# EAGLE schematic 7seg_clock (EAGLE 9.6.2)
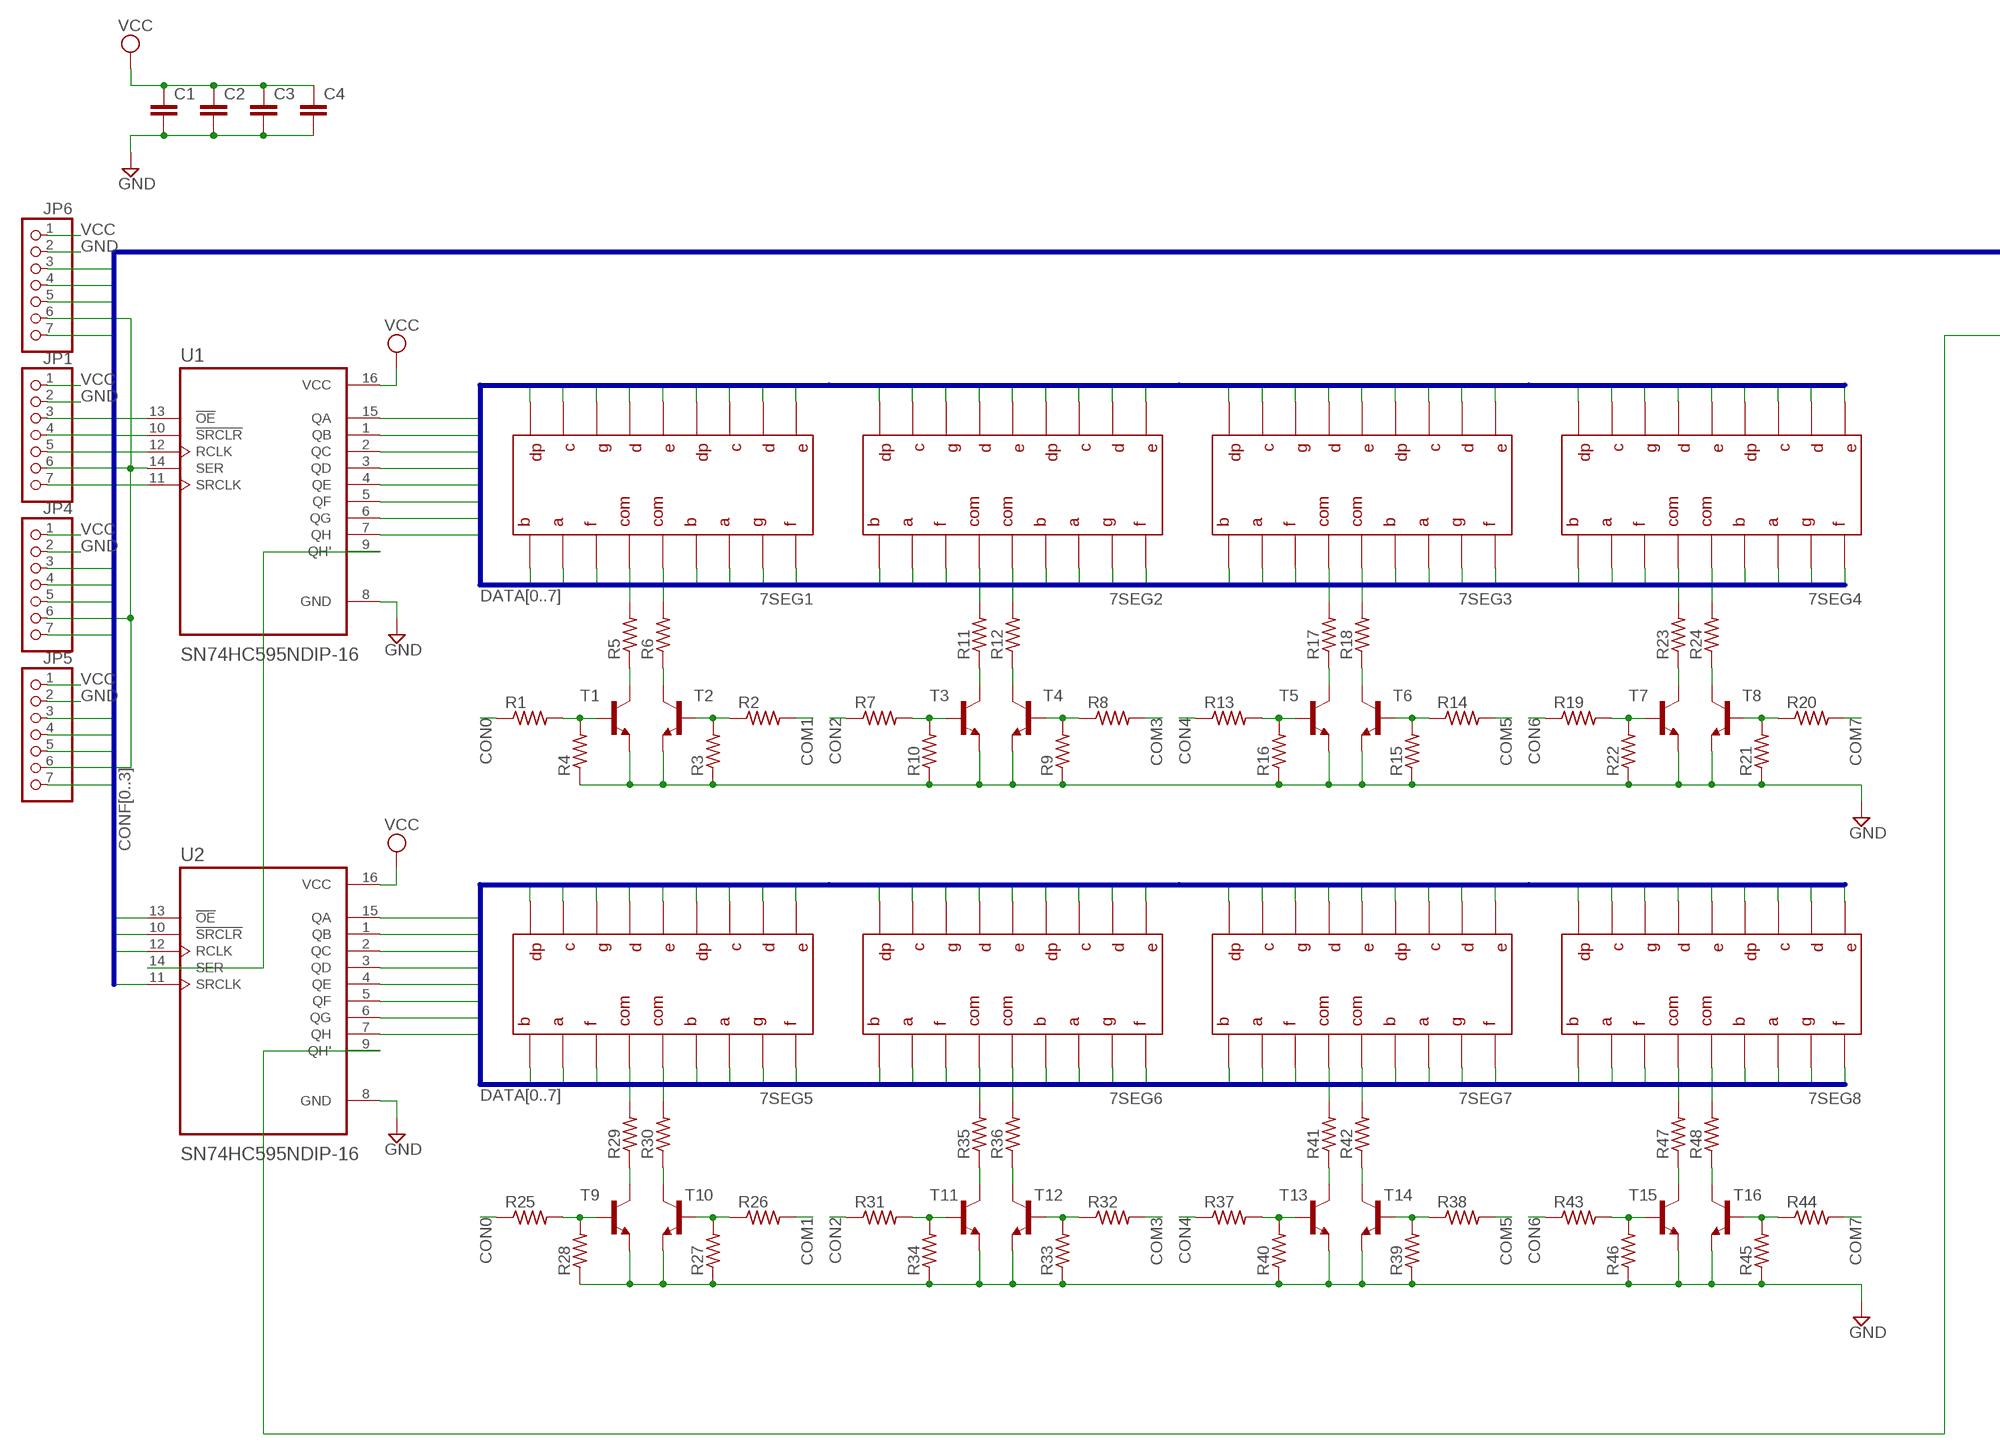
[diagram p0: schematic, sheet 1, part 1 of 2]
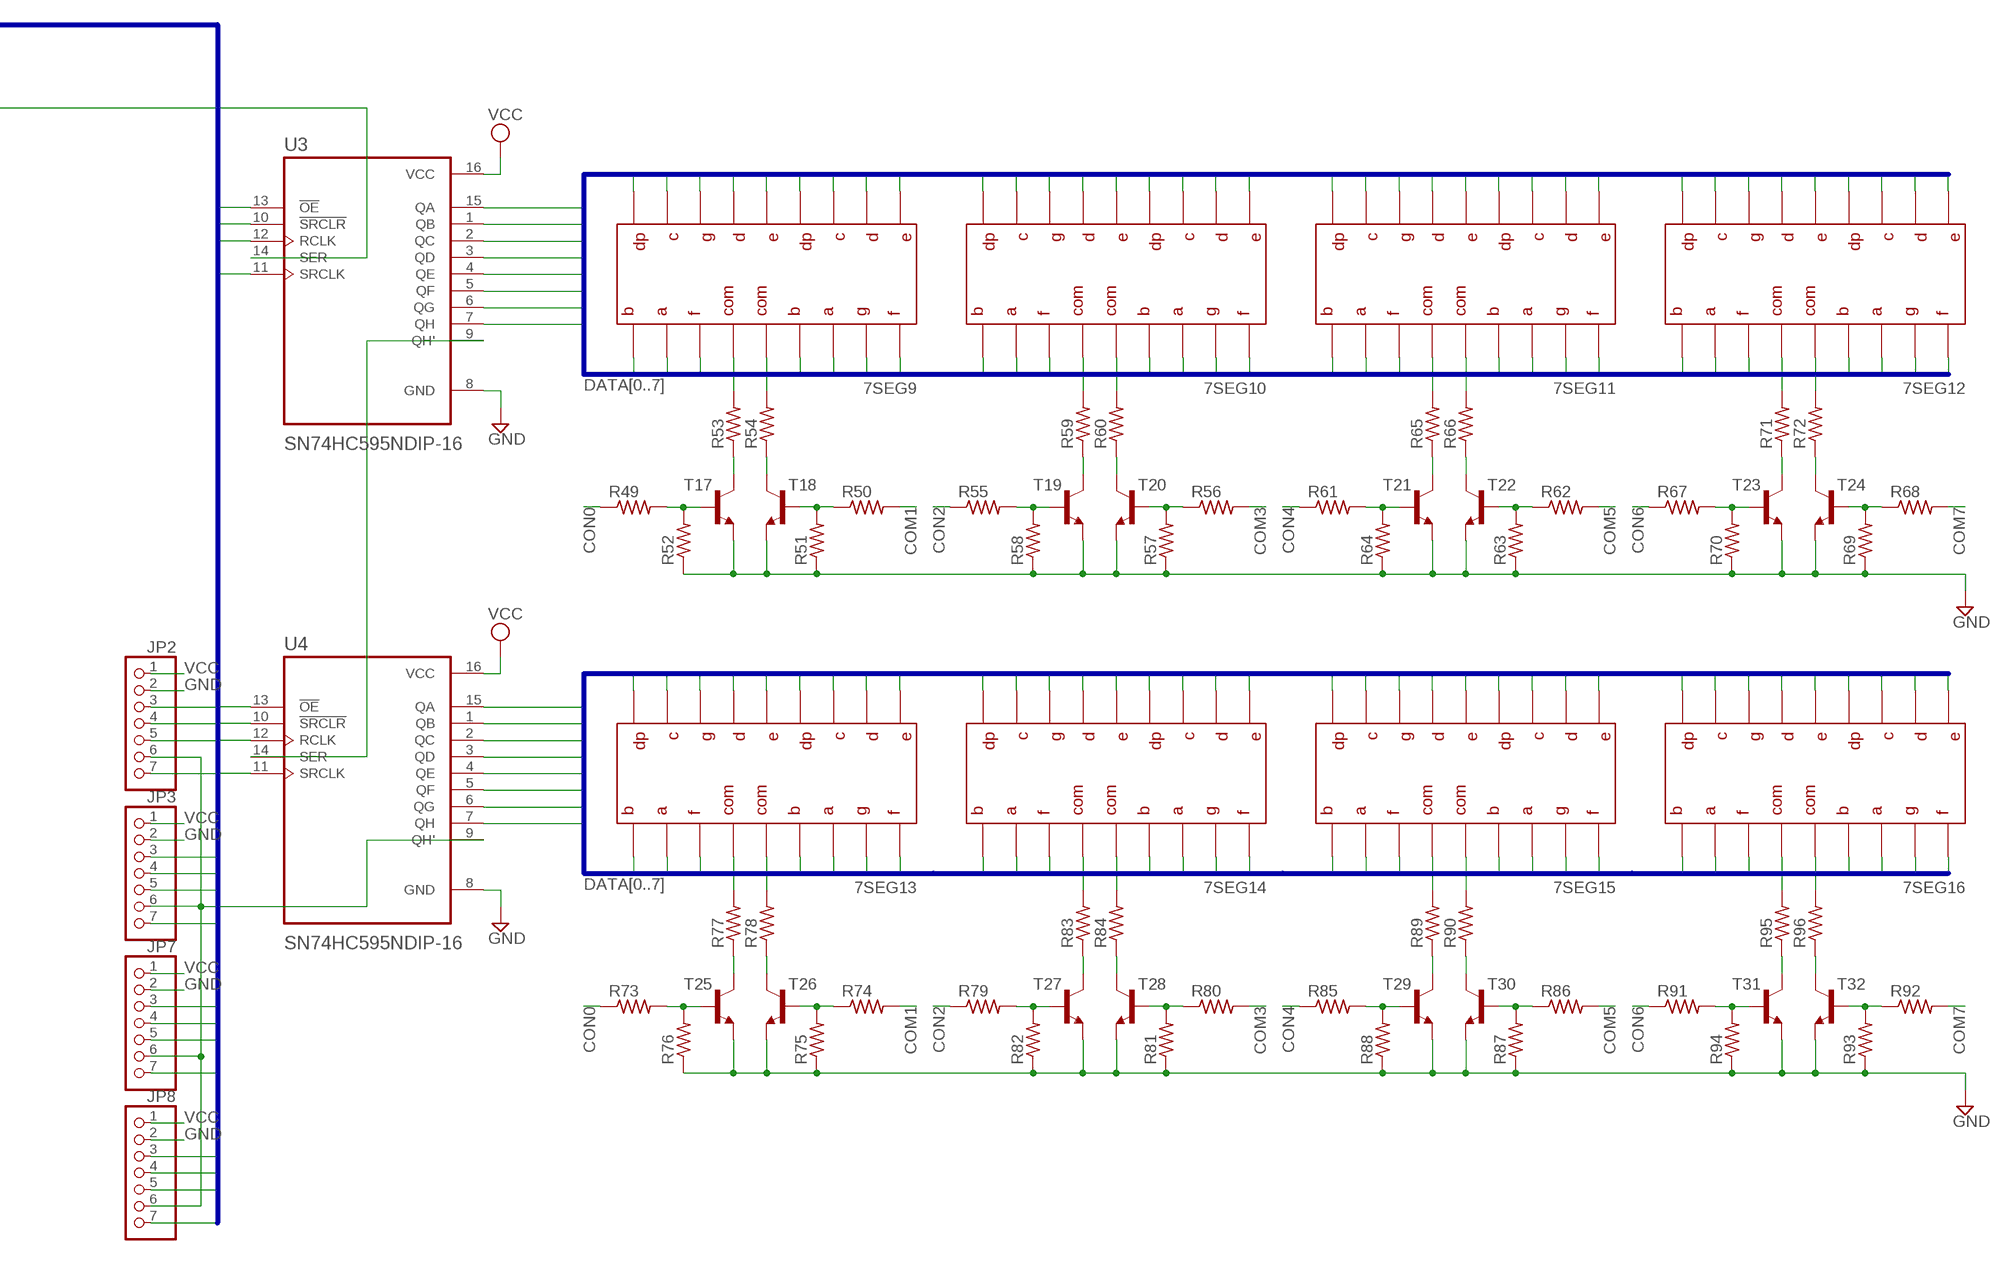
[diagram p1: schematic, sheet 1, part 2 of 2]

## Parts
7SEG1  SL-3264  [SL-3264]
7SEG2  SL-3264  [SL-3264]
7SEG3  SL-3264  [SL-3264]
7SEG4  SL-3264  [SL-3264]
7SEG5  SL-3264  [SL-3264]
7SEG6  SL-3264  [SL-3264]
7SEG7  SL-3264  [SL-3264]
7SEG8  SL-3264  [SL-3264]
7SEG9  SL-3264  [SL-3264]
7SEG10  SL-3264  [SL-3264]
7SEG11  SL-3264  [SL-3264]
7SEG12  SL-3264  [SL-3264]
7SEG13  SL-3264  [SL-3264]
7SEG14  SL-3264  [SL-3264]
7SEG15  SL-3264  [SL-3264]
7SEG16  SL-3264  [SL-3264]
C1  C-EU025-024X044  [C025-024X044]
C2  C-EU025-024X044  [C025-024X044]
C3  C-EU025-024X044  [C025-024X044]
C4  C-EU025-024X044  [C025-024X044]
JP1  PINHD-1X7  [1X07]
JP2  PINHD-1X7  [1X07]
JP3  PINHD-1X7  [1X07]
JP4  PINHD-1X7  [1X07]
JP5  PINHD-1X7  [1X07]
JP6  PINHD-1X7  [1X07]
JP7  PINHD-1X7  [1X07]
JP8  PINHD-1X7  [1X07]
R1  R-US_0207/10  [0207/10]
R2  R-US_0207/10  [0207/10]
R3  R-US_0207/10  [0207/10]
R4  R-US_0207/10  [0207/10]
R5  R-US_0207/10  [0207/10]
R6  R-US_0207/10  [0207/10]
R7  R-US_0207/10  [0207/10]
R8  R-US_0207/10  [0207/10]
R9  R-US_0207/10  [0207/10]
R10  R-US_0207/10  [0207/10]
R11  R-US_0207/10  [0207/10]
R12  R-US_0207/10  [0207/10]
R13  R-US_0207/10  [0207/10]
R14  R-US_0207/10  [0207/10]
R15  R-US_0207/10  [0207/10]
R16  R-US_0207/10  [0207/10]
R17  R-US_0207/10  [0207/10]
R18  R-US_0207/10  [0207/10]
R19  R-US_0207/10  [0207/10]
R20  R-US_0207/10  [0207/10]
R21  R-US_0207/10  [0207/10]
R22  R-US_0207/10  [0207/10]
R23  R-US_0207/10  [0207/10]
R24  R-US_0207/10  [0207/10]
R25  R-US_0207/10  [0207/10]
R26  R-US_0207/10  [0207/10]
R27  R-US_0207/10  [0207/10]
R28  R-US_0207/10  [0207/10]
R29  R-US_0207/10  [0207/10]
R30  R-US_0207/10  [0207/10]
R31  R-US_0207/10  [0207/10]
R32  R-US_0207/10  [0207/10]
R33  R-US_0207/10  [0207/10]
R34  R-US_0207/10  [0207/10]
R35  R-US_0207/10  [0207/10]
R36  R-US_0207/10  [0207/10]
R37  R-US_0207/10  [0207/10]
R38  R-US_0207/10  [0207/10]
R39  R-US_0207/10  [0207/10]
R40  R-US_0207/10  [0207/10]
R41  R-US_0207/10  [0207/10]
R42  R-US_0207/10  [0207/10]
R43  R-US_0207/10  [0207/10]
R44  R-US_0207/10  [0207/10]
R45  R-US_0207/10  [0207/10]
R46  R-US_0207/10  [0207/10]
R47  R-US_0207/10  [0207/10]
R48  R-US_0207/10  [0207/10]
R49  R-US_0207/10  [0207/10]
R50  R-US_0207/10  [0207/10]
R51  R-US_0207/10  [0207/10]
R52  R-US_0207/10  [0207/10]
R53  R-US_0207/10  [0207/10]
R54  R-US_0207/10  [0207/10]
R55  R-US_0207/10  [0207/10]
R56  R-US_0207/10  [0207/10]
R57  R-US_0207/10  [0207/10]
R58  R-US_0207/10  [0207/10]
R59  R-US_0207/10  [0207/10]
R60  R-US_0207/10  [0207/10]
R61  R-US_0207/10  [0207/10]
R62  R-US_0207/10  [0207/10]
R63  R-US_0207/10  [0207/10]
R64  R-US_0207/10  [0207/10]
R65  R-US_0207/10  [0207/10]
R66  R-US_0207/10  [0207/10]
R67  R-US_0207/10  [0207/10]
R68  R-US_0207/10  [0207/10]
R69  R-US_0207/10  [0207/10]
R70  R-US_0207/10  [0207/10]
R71  R-US_0207/10  [0207/10]
R72  R-US_0207/10  [0207/10]
R73  R-US_0207/10  [0207/10]
R74  R-US_0207/10  [0207/10]
R75  R-US_0207/10  [0207/10]
R76  R-US_0207/10  [0207/10]
R77  R-US_0207/10  [0207/10]
R78  R-US_0207/10  [0207/10]
R79  R-US_0207/10  [0207/10]
R80  R-US_0207/10  [0207/10]
R81  R-US_0207/10  [0207/10]
R82  R-US_0207/10  [0207/10]
R83  R-US_0207/10  [0207/10]
R84  R-US_0207/10  [0207/10]
R85  R-US_0207/10  [0207/10]
R86  R-US_0207/10  [0207/10]
R87  R-US_0207/10  [0207/10]
R88  R-US_0207/10  [0207/10]
R89  R-US_0207/10  [0207/10]
R90  R-US_0207/10  [0207/10]
R91  R-US_0207/10  [0207/10]
R92  R-US_0207/10  [0207/10]
R93  R-US_0207/10  [0207/10]
R94  R-US_0207/10  [0207/10]
R95  R-US_0207/10  [0207/10]
R96  R-US_0207/10  [0207/10]
T1  -NPN-TO92-BCE  [TO92-BCE]
T2  -NPN-TO92-BCE  [TO92-BCE]
T3  -NPN-TO92-BCE  [TO92-BCE]
T4  -NPN-TO92-BCE  [TO92-BCE]
T5  -NPN-TO92-BCE  [TO92-BCE]
T6  -NPN-TO92-BCE  [TO92-BCE]
T7  -NPN-TO92-BCE  [TO92-BCE]
T8  -NPN-TO92-BCE  [TO92-BCE]
T9  -NPN-TO92-BCE  [TO92-BCE]
T10  -NPN-TO92-BCE  [TO92-BCE]
T11  -NPN-TO92-BCE  [TO92-BCE]
T12  -NPN-TO92-BCE  [TO92-BCE]
T13  -NPN-TO92-BCE  [TO92-BCE]
T14  -NPN-TO92-BCE  [TO92-BCE]
T15  -NPN-TO92-BCE  [TO92-BCE]
T16  -NPN-TO92-BCE  [TO92-BCE]
T17  -NPN-TO92-BCE  [TO92-BCE]
T18  -NPN-TO92-BCE  [TO92-BCE]
T19  -NPN-TO92-BCE  [TO92-BCE]
T20  -NPN-TO92-BCE  [TO92-BCE]
T21  -NPN-TO92-BCE  [TO92-BCE]
T22  -NPN-TO92-BCE  [TO92-BCE]
T23  -NPN-TO92-BCE  [TO92-BCE]
T24  -NPN-TO92-BCE  [TO92-BCE]
T25  -NPN-TO92-BCE  [TO92-BCE]
T26  -NPN-TO92-BCE  [TO92-BCE]
T27  -NPN-TO92-BCE  [TO92-BCE]
T28  -NPN-TO92-BCE  [TO92-BCE]
T29  -NPN-TO92-BCE  [TO92-BCE]
T30  -NPN-TO92-BCE  [TO92-BCE]
T31  -NPN-TO92-BCE  [TO92-BCE]
T32  -NPN-TO92-BCE  [TO92-BCE]
U1  SN74HC595NDIP-16  [DIP794W45P254L1969H508Q16]
U2  SN74HC595NDIP-16  [DIP794W45P254L1969H508Q16]
U3  SN74HC595NDIP-16  [DIP794W45P254L1969H508Q16]
U4  SN74HC595NDIP-16  [DIP794W45P254L1969H508Q16]

## Nets
COM1: R2.2 R26.2 R50.2 R74.2
COM3: R8.2 R32.2 R56.2 R80.2
COM5: R14.2 R38.2 R62.2 R86.2
COM7: R20.2 R44.2 R68.2 R92.2
CON0: R1.1 R25.1 R49.1 R73.1
CON2: R7.1 R31.1 R55.1 R79.1
CON4: R13.1 R37.1 R61.1 R85.1
CON6: R19.1 R43.1 R67.1 R91.1
CONF0: JP1.3 JP2.3 JP3.3 JP4.3 JP5.3 JP6.3 JP7.3 JP8.3 U1.13(!OE) U2.13(!OE) U3.13(!OE) U4.13(!OE)
CONF1: JP1.4 JP2.4 JP3.4 JP4.4 JP5.4 JP6.4 JP7.4 JP8.4 U1.10(!SRCLR) U2.10(!SRCLR) U3.10(!SRCLR) U4.10(!SRCLR)
CONF2: JP1.5 JP2.5 JP3.5 JP4.5 JP5.5 JP6.5 JP7.5 JP8.5 U1.12(RCLK) U2.12(RCLK) U3.12(RCLK) U4.12(RCLK)
CONF3: JP1.7 JP2.7 JP3.7 JP4.7 JP5.7 JP6.7 JP7.7 JP8.7 U1.11(SRCLK) U2.11(SRCLK) U3.11(SRCLK) U4.11(SRCLK)
DATA0: 7SEG1.P$11 7SEG1.P$16 7SEG2.P$11 7SEG2.P$16 7SEG3.P$11 7SEG3.P$16 7SEG4.P$11 7SEG4.P$16 7SEG5.P$11 7SEG5.P$16 7SEG6.P$11 7SEG6.P$16 7SEG7.P$11 7SEG7.P$16 7SEG8.P$11 7SEG8.P$16 7SEG9.P$11 7SEG9.P$16 7SEG10.P$11 7SEG10.P$16 7SEG11.P$11 7SEG11.P$16 7SEG12.P$11 7SEG12.P$16 7SEG13.P$11 7SEG13.P$16 7SEG14.P$11 7SEG14.P$16 7SEG15.P$11 7SEG15.P$16 7SEG16.P$11 7SEG16.P$16 U1.15(QA) U2.15(QA) U3.15(QA) U4.15(QA)
DATA1: 7SEG1.P$10 7SEG1.P$15 7SEG2.P$10 7SEG2.P$15 7SEG3.P$10 7SEG3.P$15 7SEG4.P$10 7SEG4.P$15 7SEG5.P$10 7SEG5.P$15 7SEG6.P$10 7SEG6.P$15 7SEG7.P$10 7SEG7.P$15 7SEG8.P$10 7SEG8.P$15 7SEG9.P$10 7SEG9.P$15 7SEG10.P$10 7SEG10.P$15 7SEG11.P$10 7SEG11.P$15 7SEG12.P$10 7SEG12.P$15 7SEG13.P$10 7SEG13.P$15 7SEG14.P$10 7SEG14.P$15 7SEG15.P$10 7SEG15.P$15 7SEG16.P$10 7SEG16.P$15 U1.1(QB) U2.1(QB) U3.1(QB) U4.1(QB)
DATA2: 7SEG1.P$3 7SEG1.P$8 7SEG2.P$3 7SEG2.P$8 7SEG3.P$3 7SEG3.P$8 7SEG4.P$3 7SEG4.P$8 7SEG5.P$3 7SEG5.P$8 7SEG6.P$3 7SEG6.P$8 7SEG7.P$3 7SEG7.P$8 7SEG8.P$3 7SEG8.P$8 7SEG9.P$3 7SEG9.P$8 7SEG10.P$3 7SEG10.P$8 7SEG11.P$3 7SEG11.P$8 7SEG12.P$3 7SEG12.P$8 7SEG13.P$3 7SEG13.P$8 7SEG14.P$3 7SEG14.P$8 7SEG15.P$3 7SEG15.P$8 7SEG16.P$3 7SEG16.P$8 U1.2(QC) U2.2(QC) U3.2(QC) U4.2(QC)
DATA3: 7SEG1.P$2 7SEG1.P$6 7SEG2.P$2 7SEG2.P$6 7SEG3.P$2 7SEG3.P$6 7SEG4.P$2 7SEG4.P$6 7SEG5.P$2 7SEG5.P$6 7SEG6.P$2 7SEG6.P$6 7SEG7.P$2 7SEG7.P$6 7SEG8.P$2 7SEG8.P$6 7SEG9.P$2 7SEG9.P$6 7SEG10.P$2 7SEG10.P$6 7SEG11.P$2 7SEG11.P$6 7SEG12.P$2 7SEG12.P$6 7SEG13.P$2 7SEG13.P$6 7SEG14.P$2 7SEG14.P$6 7SEG15.P$2 7SEG15.P$6 7SEG16.P$2 7SEG16.P$6 U1.3(QD) U2.3(QD) U3.3(QD) U4.3(QD)
DATA4: 7SEG1.P$1 7SEG1.P$5 7SEG2.P$1 7SEG2.P$5 7SEG3.P$1 7SEG3.P$5 7SEG4.P$1 7SEG4.P$5 7SEG5.P$1 7SEG5.P$5 7SEG6.P$1 7SEG6.P$5 7SEG7.P$1 7SEG7.P$5 7SEG8.P$1 7SEG8.P$5 7SEG9.P$1 7SEG9.P$5 7SEG10.P$1 7SEG10.P$5 7SEG11.P$1 7SEG11.P$5 7SEG12.P$1 7SEG12.P$5 7SEG13.P$1 7SEG13.P$5 7SEG14.P$1 7SEG14.P$5 7SEG15.P$1 7SEG15.P$5 7SEG16.P$1 7SEG16.P$5 U1.4(QE) U2.4(QE) U3.4(QE) U4.4(QE)
DATA5: 7SEG1.P$12 7SEG1.P$18 7SEG2.P$12 7SEG2.P$18 7SEG3.P$12 7SEG3.P$18 7SEG4.P$12 7SEG4.P$18 7SEG5.P$12 7SEG5.P$18 7SEG6.P$12 7SEG6.P$18 7SEG7.P$12 7SEG7.P$18 7SEG8.P$12 7SEG8.P$18 7SEG9.P$12 7SEG9.P$18 7SEG10.P$12 7SEG10.P$18 7SEG11.P$12 7SEG11.P$18 7SEG12.P$12 7SEG12.P$18 7SEG13.P$12 7SEG13.P$18 7SEG14.P$12 7SEG14.P$18 7SEG15.P$12 7SEG15.P$18 7SEG16.P$12 7SEG16.P$18 U1.5(QF) U2.5(QF) U3.5(QF) U4.5(QF)
DATA6: 7SEG1.P$7 7SEG1.P$17 7SEG2.P$7 7SEG2.P$17 7SEG3.P$7 7SEG3.P$17 7SEG4.P$7 7SEG4.P$17 7SEG5.P$7 7SEG5.P$17 7SEG6.P$7 7SEG6.P$17 7SEG7.P$7 7SEG7.P$17 7SEG8.P$7 7SEG8.P$17 7SEG9.P$7 7SEG9.P$17 7SEG10.P$7 7SEG10.P$17 7SEG11.P$7 7SEG11.P$17 7SEG12.P$7 7SEG12.P$17 7SEG13.P$7 7SEG13.P$17 7SEG14.P$7 7SEG14.P$17 7SEG15.P$7 7SEG15.P$17 7SEG16.P$7 7SEG16.P$17 U1.6(QG) U2.6(QG) U3.6(QG) U4.6(QG)
DATA7: 7SEG1.P$4 7SEG1.P$9 7SEG2.P$4 7SEG2.P$9 7SEG3.P$4 7SEG3.P$9 7SEG4.P$4 7SEG4.P$9 7SEG5.P$4 7SEG5.P$9 7SEG6.P$4 7SEG6.P$9 7SEG7.P$4 7SEG7.P$9 7SEG8.P$4 7SEG8.P$9 7SEG9.P$4 7SEG9.P$9 7SEG10.P$4 7SEG10.P$9 7SEG11.P$4 7SEG11.P$9 7SEG12.P$4 7SEG12.P$9 7SEG13.P$4 7SEG13.P$9 7SEG14.P$4 7SEG14.P$9 7SEG15.P$4 7SEG15.P$9 7SEG16.P$4 7SEG16.P$9 U1.7(QH) U2.7(QH) U3.7(QH) U4.7(QH)
GND: C1.2 C2.2 C3.2 C4.2 JP1.2 JP2.2 JP3.2 JP4.2 JP5.2 JP6.2 JP7.2 JP8.2 R3.1 R4.1 R9.1 R10.1 R15.1 R16.1 R21.1 R22.1 R27.1 R28.1 R33.1 R34.1 R39.1 R40.1 R45.1 R46.1 R51.1 R52.1 R57.1 R58.1 R63.1 R64.1 R69.1 R70.1 R75.1 R76.1 R81.1 R82.1 R87.1 R88.1 R93.1 R94.1 T1.E T2.E T3.E T4.E T5.E T6.E T7.E T8.E T9.E T10.E T11.E T12.E T13.E T14.E T15.E T16.E T17.E T18.E T19.E T20.E T21.E T22.E T23.E T24.E T25.E T26.E T27.E T28.E T29.E T30.E T31.E T32.E U1.8(GND) U2.8(GND) U3.8(GND) U4.8(GND)
N$1: R5.1 T1.C
N$2: R6.1 T2.C
N$3: R2.1 R3.2 T2.B
N$4: R11.1 T3.C
N$5: R12.1 T4.C
N$6: R7.2 R10.2 T3.B
N$7: R29.1 T9.C
N$8: R8.1 R9.2 T4.B
N$9: R1.2 R4.2 T1.B
N$10: R17.1 T5.C
N$11: R18.1 T6.C
N$12: R30.1 T10.C
N$13: R13.2 R16.2 T5.B
N$14: R25.2 R28.2 T9.B
N$15: R14.1 R15.2 T6.B
N$16: R23.1 T7.C
N$17: R24.1 T8.C
N$18: R19.2 R22.2 T7.B
N$19: R26.1 R27.2 T10.B
N$20: R20.1 R21.2 T8.B
N$21: R35.1 T11.C
N$22: R36.1 T12.C
N$23: R31.2 R34.2 T11.B
N$24: R32.1 R33.2 T12.B
N$25: R41.1 T13.C
N$26: R42.1 T14.C
N$27: R37.2 R40.2 T13.B
N$28: R38.1 R39.2 T14.B
N$29: R47.1 T15.C
N$30: R48.1 T16.C
N$31: R43.2 R46.2 T15.B
N$32: R44.1 R45.2 T16.B
N$33: JP1.6 JP4.6 JP5.6 JP6.6 U1.14(SER)
N$34: U1.9(QH') U2.14(SER)
N$35: U2.9(QH') U3.14(SER)
N$36: R53.1 T17.C
N$37: R54.1 T18.C
N$38: R49.2 R52.2 T17.B
N$39: R50.1 R51.2 T18.B
N$40: R59.1 T19.C
N$41: R60.1 T20.C
N$42: R55.2 R58.2 T19.B
N$43: R56.1 R57.2 T20.B
N$44: R65.1 T21.C
N$45: R66.1 T22.C
N$46: R61.2 R64.2 T21.B
N$47: R62.1 R63.2 T22.B
N$48: R71.1 T23.C
N$49: R72.1 T24.C
N$50: R67.2 R70.2 T23.B
N$51: R68.1 R69.2 T24.B
N$52: R77.1 T25.C
N$53: R78.1 T26.C
N$54: R73.2 R76.2 T25.B
N$55: R74.1 R75.2 T26.B
N$56: R83.1 T27.C
N$57: R84.1 T28.C
N$58: R79.2 R82.2 T27.B
N$59: R80.1 R81.2 T28.B
N$60: R89.1 T29.C
N$61: R90.1 T30.C
N$62: R85.2 R88.2 T29.B
N$63: R86.1 R87.2 T30.B
N$64: R95.1 T31.C
N$65: R96.1 T32.C
N$66: R91.2 R94.2 T31.B
N$67: R92.1 R93.2 T32.B
N$68: JP2.6 JP3.6 JP7.6 JP8.6 U4.9(QH')
N$69: U3.9(QH') U4.14(SER)
P$13: 7SEG1.P$13 7SEG2.P$13 7SEG3.P$13 7SEG4.P$13 7SEG5.P$13 7SEG6.P$13 7SEG7.P$13 7SEG8.P$13 7SEG9.P$13 7SEG10.P$13 7SEG11.P$13 7SEG12.P$13 7SEG13.P$13 7SEG14.P$13 7SEG15.P$13 7SEG16.P$13 R5.2 R11.2 R17.2 R23.2 R29.2 R35.2 R41.2 R47.2 R53.2 R59.2 R65.2 R71.2 R77.2 R83.2 R89.2 R95.2
P$14: 7SEG1.P$14 7SEG2.P$14 7SEG3.P$14 7SEG4.P$14 7SEG5.P$14 7SEG6.P$14 7SEG7.P$14 7SEG8.P$14 7SEG9.P$14 7SEG10.P$14 7SEG11.P$14 7SEG12.P$14 7SEG13.P$14 7SEG14.P$14 7SEG15.P$14 7SEG16.P$14 R6.2 R12.2 R18.2 R24.2 R30.2 R36.2 R42.2 R48.2 R54.2 R60.2 R66.2 R72.2 R78.2 R84.2 R90.2 R96.2
VCC: C1.1 C2.1 JP1.1 JP2.1 JP3.1 JP4.1 JP5.1 JP6.1 JP7.1 JP8.1 U1.16(VCC) U2.16(VCC) U3.16(VCC) U4.16(VCC)
VCC1: C3.1 C4.1

## Buses
DATA[0..7]
CONF[0..3]

## Library data of the parts
7SEG1-7SEG16 = SL3264:SL-3264; SL-3264: 三洋 7セグメントLED
C1-C4 = myParts:C-EU: CAPACITOR, European symbol; SPICEPREFIX: C
JP1-JP8 = Connector:PINHD-1X7: PIN HEADER; CATEGORY: CONNECTOR; SUB-CATEGORY: PIN-HEADER
R1-R96 = myParts:R-US_: RESISTOR, American symbol; SPICEPREFIX: R
T1-T32 = DC_LOAD_AU:*-NPN-: NPN Transistror BF959 corrected 2008.03.06
U1-U4 = SN74HC595N:SN74HC595N: Check availability <https://pricing.snapeda.com/parts/SN74HC595N/Texas%20Instruments/view-part?ref=eda>; AVAILABILITY: In Stock; DESCRIPTION: 8-bit shift registers with 3-state output registers; MF: Texas Instruments; MP: SN74HC595N; PACKAGE: PDIP-16 Texas Instruments; PRICE: None; PURCHASE-URL: https://pricing.snapeda.com/search/part/SN74HC595N/?ref=eda